# EasyEDA schematic Sheet_2.json
TITLE: 8 Bit ALU - CMP 1; REV: 1.0; Date: 2021-12-30; Sheet: 2/3; Drawn By: Koehler, Paul; Company: komed3
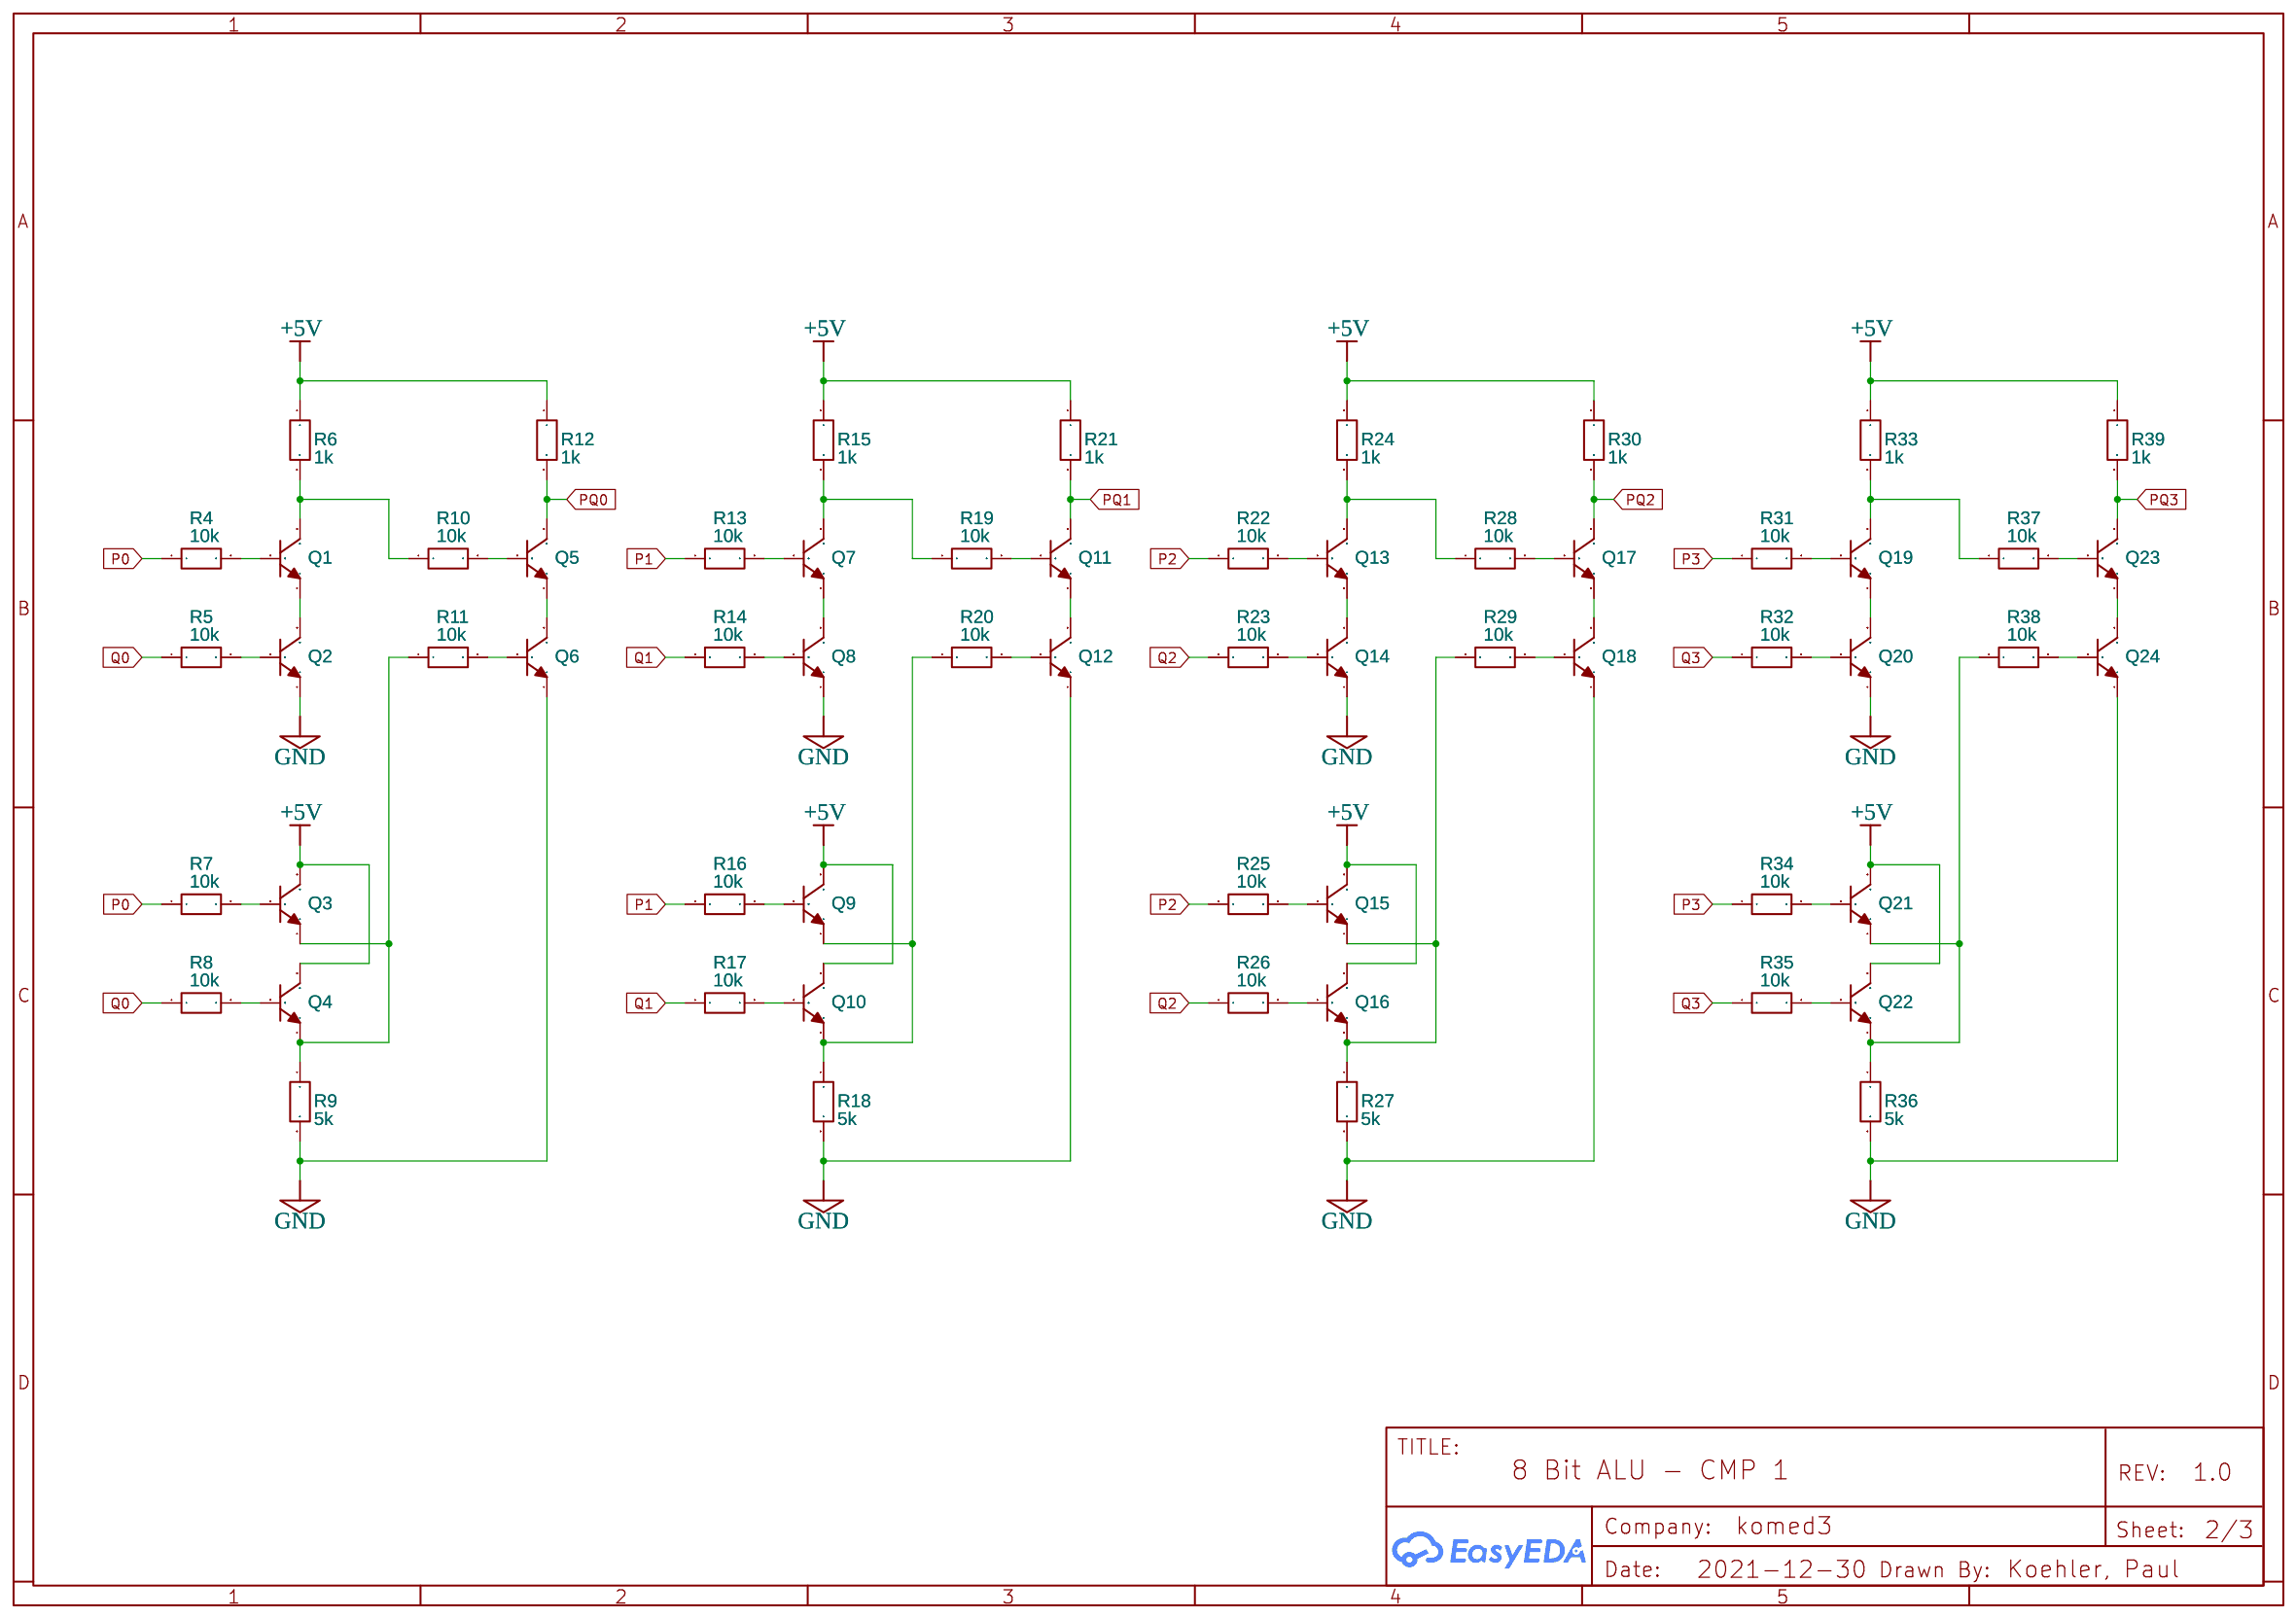
[diagram p0: schematic sheet]

## Parts
Q1  2N3904(TO-92)  [TO-92-3_L5.1-W4.1-P1.27-L]
Q2  2N3904(TO-92)  [TO-92-3_L5.1-W4.1-P1.27-L]
Q3  2N3904(TO-92)  [TO-92-3_L5.1-W4.1-P1.27-L]
Q4  2N3904(TO-92)  [TO-92-3_L5.1-W4.1-P1.27-L]
Q5  2N3904(TO-92)  [TO-92-3_L5.1-W4.1-P1.27-L]
Q6  2N3904(TO-92)  [TO-92-3_L5.1-W4.1-P1.27-L]
Q7  2N3904(TO-92)  [TO-92-3_L5.1-W4.1-P1.27-L]
Q8  2N3904(TO-92)  [TO-92-3_L5.1-W4.1-P1.27-L]
Q9  2N3904(TO-92)  [TO-92-3_L5.1-W4.1-P1.27-L]
Q10  2N3904(TO-92)  [TO-92-3_L5.1-W4.1-P1.27-L]
Q11  2N3904(TO-92)  [TO-92-3_L5.1-W4.1-P1.27-L]
Q12  2N3904(TO-92)  [TO-92-3_L5.1-W4.1-P1.27-L]
Q13  2N3904(TO-92)  [TO-92-3_L5.1-W4.1-P1.27-L]
Q14  2N3904(TO-92)  [TO-92-3_L5.1-W4.1-P1.27-L]
Q15  2N3904(TO-92)  [TO-92-3_L5.1-W4.1-P1.27-L]
Q16  2N3904(TO-92)  [TO-92-3_L5.1-W4.1-P1.27-L]
Q17  2N3904(TO-92)  [TO-92-3_L5.1-W4.1-P1.27-L]
Q18  2N3904(TO-92)  [TO-92-3_L5.1-W4.1-P1.27-L]
Q19  2N3904(TO-92)  [TO-92-3_L5.1-W4.1-P1.27-L]
Q20  2N3904(TO-92)  [TO-92-3_L5.1-W4.1-P1.27-L]
Q21  2N3904(TO-92)  [TO-92-3_L5.1-W4.1-P1.27-L]
Q22  2N3904(TO-92)  [TO-92-3_L5.1-W4.1-P1.27-L]
Q23  2N3904(TO-92)  [TO-92-3_L5.1-W4.1-P1.27-L]
Q24  2N3904(TO-92)  [TO-92-3_L5.1-W4.1-P1.27-L]
R4  10k  [R_AXIAL-0.3]
R5  10k  [R_AXIAL-0.3]
R6  1k  [R_AXIAL-0.3]
R7  10k  [R_AXIAL-0.3]
R8  10k  [R_AXIAL-0.3]
R9  5k  [R_AXIAL-0.3]
R10  10k  [R_AXIAL-0.3]
R11  10k  [R_AXIAL-0.3]
R12  1k  [R_AXIAL-0.3]
R13  10k  [R_AXIAL-0.3]
R14  10k  [R_AXIAL-0.3]
R15  1k  [R_AXIAL-0.3]
R16  10k  [R_AXIAL-0.3]
R17  10k  [R_AXIAL-0.3]
R18  5k  [R_AXIAL-0.3]
R19  10k  [R_AXIAL-0.3]
R20  10k  [R_AXIAL-0.3]
R21  1k  [R_AXIAL-0.3]
R22  10k  [R_AXIAL-0.3]
R23  10k  [R_AXIAL-0.3]
R24  1k  [R_AXIAL-0.3]
R25  10k  [R_AXIAL-0.3]
R26  10k  [R_AXIAL-0.3]
R27  5k  [R_AXIAL-0.3]
R28  10k  [R_AXIAL-0.3]
R29  10k  [R_AXIAL-0.3]
R30  1k  [R_AXIAL-0.3]
R31  10k  [R_AXIAL-0.3]
R32  10k  [R_AXIAL-0.3]
R33  1k  [R_AXIAL-0.3]
R34  10k  [R_AXIAL-0.3]
R35  10k  [R_AXIAL-0.3]
R36  5k  [R_AXIAL-0.3]
R37  10k  [R_AXIAL-0.3]
R38  10k  [R_AXIAL-0.3]
R39  1k  [R_AXIAL-0.3]

## Library data of the parts
Q1-Q24 = 2N3904(TO-92): Supplier: LCSC; Manufacturer: SEMTECH; Manufacturer Part: 2N3904; Supplier Part: C118538; Contributor: LCEDA_Lib
R4-R39 = R_AXIAL-0.3_EU: Contributor: LCEDA_Lib

## Nets
+5V: Q3.3(C) Q4.3(C) Q9.3(C) Q10.3(C) Q15.3(C) Q16.3(C) Q21.3(C) Q22.3(C) R6.1 R12.1 R15.1 R21.1 R24.1 R30.1 R33.1 R39.1
GND: Q2.1(E) Q6.1(E) Q8.1(E) Q12.1(E) Q14.1(E) Q18.1(E) Q20.1(E) Q24.1(E) R9.2 R18.2 R27.2 R36.2
P0: R4.1 R7.1
P1: R13.1 R16.1
P2: R22.1 R25.1
P3: R31.1 R34.1
PQ0: Q5.3(C) R12.2
PQ1: Q11.3(C) R21.2
PQ2: Q17.3(C) R30.2
PQ3: Q23.3(C) R39.2
Q0: R5.1 R8.1
Q1: R14.1 R17.1
Q2: R23.1 R26.1
Q3: R32.1 R35.1
Net-(Q1-1): Q1.1(E) Q2.3(C)
Net-(Q1-2): Q1.2(B) R4.2
Net-(Q1-3): Q1.3(C) R6.2 R10.1
Net-(Q2-2): Q2.2(B) R5.2
Net-(Q3-1): Q3.1(E) Q4.1(E) R9.1 R11.1
Net-(Q3-2): Q3.2(B) R7.2
Net-(Q4-2): Q4.2(B) R8.2
Net-(Q5-1): Q5.1(E) Q6.3(C)
Net-(Q5-2): Q5.2(B) R10.2
Net-(Q6-2): Q6.2(B) R11.2
Net-(Q7-1): Q7.1(E) Q8.3(C)
Net-(Q7-2): Q7.2(B) R13.2
Net-(Q7-3): Q7.3(C) R15.2 R19.1
Net-(Q8-2): Q8.2(B) R14.2
Net-(Q9-1): Q9.1(E) Q10.1(E) R18.1 R20.1
Net-(Q9-2): Q9.2(B) R16.2
Net-(Q10-2): Q10.2(B) R17.2
Net-(Q11-1): Q11.1(E) Q12.3(C)
Net-(Q11-2): Q11.2(B) R19.2
Net-(Q12-2): Q12.2(B) R20.2
Net-(Q13-1): Q13.1(E) Q14.3(C)
Net-(Q13-2): Q13.2(B) R22.2
Net-(Q13-3): Q13.3(C) R24.2 R28.1
Net-(Q14-2): Q14.2(B) R23.2
Net-(Q15-1): Q15.1(E) Q16.1(E) R27.1 R29.1
Net-(Q15-2): Q15.2(B) R25.2
Net-(Q16-2): Q16.2(B) R26.2
Net-(Q17-1): Q17.1(E) Q18.3(C)
Net-(Q17-2): Q17.2(B) R28.2
Net-(Q18-2): Q18.2(B) R29.2
Net-(Q19-1): Q19.1(E) Q20.3(C)
Net-(Q19-2): Q19.2(B) R31.2
Net-(Q19-3): Q19.3(C) R33.2 R37.1
Net-(Q20-2): Q20.2(B) R32.2
Net-(Q21-1): Q21.1(E) Q22.1(E) R36.1 R38.1
Net-(Q21-2): Q21.2(B) R34.2
Net-(Q22-2): Q22.2(B) R35.2
Net-(Q23-1): Q23.1(E) Q24.3(C)
Net-(Q23-2): Q23.2(B) R37.2
Net-(Q24-2): Q24.2(B) R38.2
